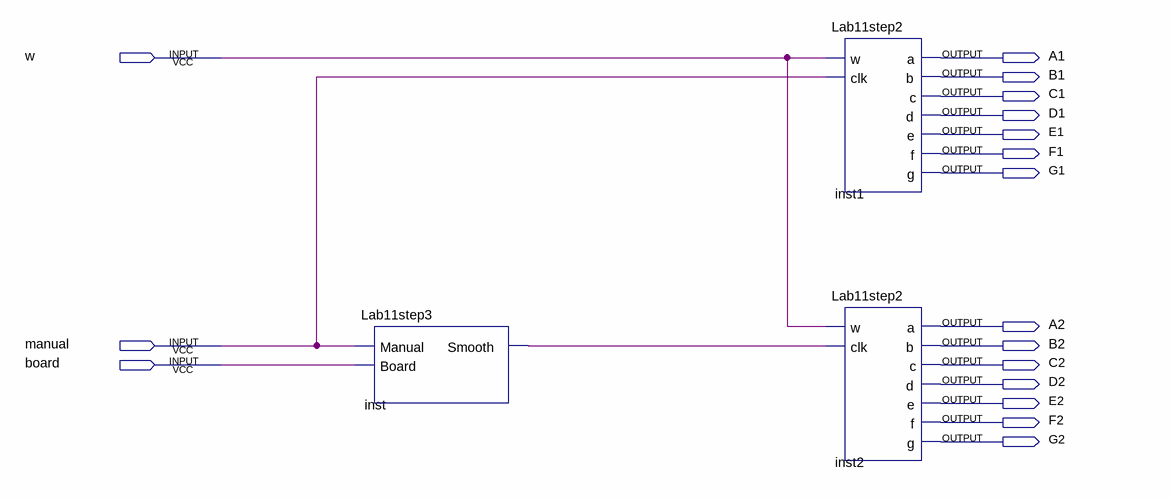
[diagram p0: schematic sheet]
// Quartus schematic Lab11step4.bdf as structural Verilog: 3 symbols, 17 pins
module Lab11step4 (
  input  w,
  input  manual,
  input  board,
  output A1,
  output B1,
  output C1,
  output D1,
  output E1,
  output F1,
  output G1,
  output A2,
  output B2,
  output C2,
  output D2,
  output E2,
  output F2,
  output G2
);

  wire inst_smooth;

  Lab11step3 inst (.Manual(manual), .Board(board), .Smooth(inst_smooth));
  Lab11step2 inst1 (.w(w), .clk(manual), .a(A1), .b(B1), .c(C1), .d(D1), .e(E1), .f(F1), .g(G1));
  Lab11step2 inst2 (.w(w), .clk(inst_smooth), .a(A2), .b(B2), .c(C2), .d(D2), .e(E2), .f(F2), .g(G2));
endmodule
